# Altium schematic sheet Decoupling.SchDoc
size A4; SheetNumber: 3; SheetTotal: 8
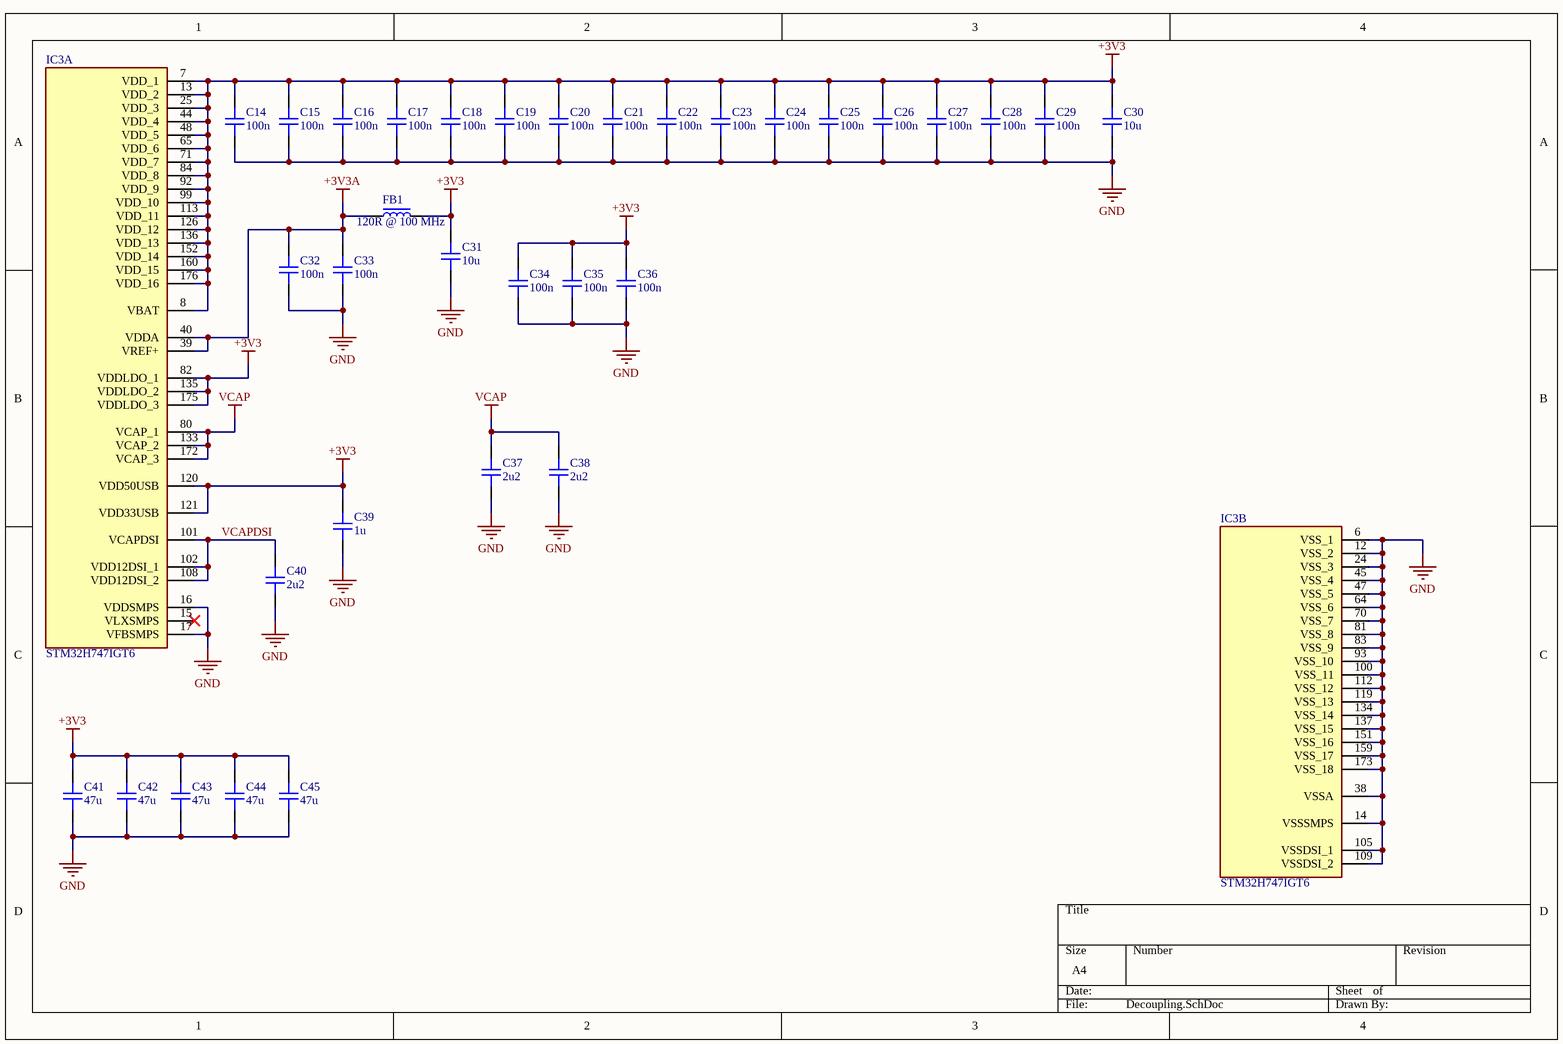
[diagram p0: Decoupling.SchDoc]

## Parts
C14  100n  [CAP_0402]
C15  100n  [CAP_0402]
C16  100n  [CAP_0402]
C17  100n  [CAP_0402]
C18  100n  [CAP_0402]
C19  100n  [CAP_0402]
C20  100n  [CAP_0402]
C21  100n  [CAP_0402]
C22  100n  [CAP_0402]
C23  100n  [CAP_0402]
C24  100n  [CAP_0402]
C25  100n  [CAP_0402]
C26  100n  [CAP_0402]
C27  100n  [CAP_0402]
C28  100n  [CAP_0402]
C29  100n  [CAP_0402]
C30  10u  [CAP_0603]
C31  10u  [CAP_0603]
C32  100n  [CAP_0402]
C33  100n  [CAP_0402]
C34  100n  [CAP_0402]
C35  100n  [CAP_0402]
C36  100n  [CAP_0402]
C37  2u2  [CAP_0402]
C38  2u2  [CAP_0402]
C39  1u  [CAP_0402]
C40  2u2  [CAP_0402]
C41  47u  [CAP_1210]
C42  47u  [CAP_1210]
C43  47u  [CAP_1210]
C44  47u  [CAP_1210]
C45  47u  [CAP_1210]
FB1  120R @ 100 MHz  [FB_0402]
IC3  STM32H747IGT6  [QFP50P2600X2600X160-176N]  (parts A,B of 10)

## Nets
+3V3: C14.2 C15.2 C16.2 C17.2 C18.2 C19.2 C20.2 C21.2 C22.2 C23.2 C24.2 C25.2 C26.2 C27.2 C28.2 C29.2 C30.2 C31.2 C34.2 C35.2 C36.2 C39.2 C41.2 C42.2 C43.2 C44.2 C45.2 FB1.2 IC3.7(VDD_1) IC3.8(VBAT) IC3.13(VDD_2) IC3.25(VDD_3) IC3.44(VDD_4) IC3.48(VDD_5) IC3.65(VDD_6) IC3.71(VDD_7) IC3.82(VDDLDO_1) IC3.84(VDD_8) IC3.92(VDD_9) IC3.99(VDD_10) IC3.113(VDD_11) IC3.120(VDD50USB) IC3.121(VDD33USB) IC3.126(VDD_12) IC3.135(VDDLDO_2) IC3.136(VDD_13) IC3.152(VDD_14) IC3.160(VDD_15) IC3.175(VDDLDO_3) IC3.176(VDD_16)
+3V3A: C32.2 C33.2 FB1.1 IC3.39(VREF+) IC3.40(VDDA)
GND: C14.1 C15.1 C16.1 C17.1 C18.1 C19.1 C20.1 C21.1 C22.1 C23.1 C24.1 C25.1 C26.1 C27.1 C28.1 C29.1 C30.1 C31.1 C32.1 C33.1 C34.1 C35.1 C36.1 C37.1 C38.1 C39.1 C40.1 C41.1 C42.1 C43.1 C44.1 C45.1 IC3.6(VSS_1) IC3.12(VSS_2) IC3.14(VSSSMPS) IC3.16(VDDSMPS) IC3.17(VFBSMPS) IC3.24(VSS_3) IC3.38(VSSA) IC3.45(VSS_4) IC3.47(VSS_5) IC3.64(VSS_6) IC3.70(VSS_7) IC3.81(VSS_8) IC3.83(VSS_9) IC3.93(VSS_10) IC3.100(VSS_11) IC3.105(VSSDSI_1) IC3.109(VSSDSI_2) IC3.112(VSS_12) IC3.119(VSS_13) IC3.134(VSS_14) IC3.137(VSS_15) IC3.151(VSS_16) IC3.159(VSS_17) IC3.173(VSS_18)
VCAP: C37.2 C38.2 IC3.80(VCAP_1) IC3.133(VCAP_2) IC3.172(VCAP_3)
VCAPDSI: C40.2 IC3.101(VCAPDSI) IC3.102(VDD12DSI_1) IC3.108(VDD12DSI_2)

Not connected (* = marked no-connect by the designer): IC3 15(VLXSMPS)*

## Library data of the parts
C14-C29 C32-C40 = CAP_0402: Capacitor SMD 0402; Manufacturer: *; Manufacturer Part Number: *; Distributor Link: *; LCSC: *; Rating: *; Dielectric: *
C30 C31 = CAP_0603: Capacitor SMD 0603; Manufacturer: *; Manufacturer Part Number: *; Distributor Link: *; LCSC: *; Rating: *; Dielectric: *
C41-C45 = CAP_1210: Capacitor SMD 1210; Manufacturer: *; Manufacturer Part Number: *; Distributor Link: *; LCSC: *; Rating: *; Dielectric: *
FB1 = FB_0402: Ferrite Bead SMD 0402; Manufacturer: *; Manufacturer Part Number: *; Distributor Link: *; LCSC: *
IC3 = STM32H747IGT6: Integrated Circuit; Manufacturer_Name: STMicroelectronics; Datasheet Link: https://www.mouser.com/datasheet/2/389/dm00602212-1799407.pdf; Height: 1.6mm; Manufacturer_Part_Number: STM32H747IGT6; Mouser Part Number: 511-STM32H747IGT6; Mouser Price/Stock: https://www.mouser.co.uk/ProductDetail/STMicroelectronics/STM32H747IGT6?qs=%252B6g0mu59x7Kw%252BsPEalqvLg%3D%3D; Arrow Part Number: STM32H747IGT6; Arrow Price/Stock: null?region=nac